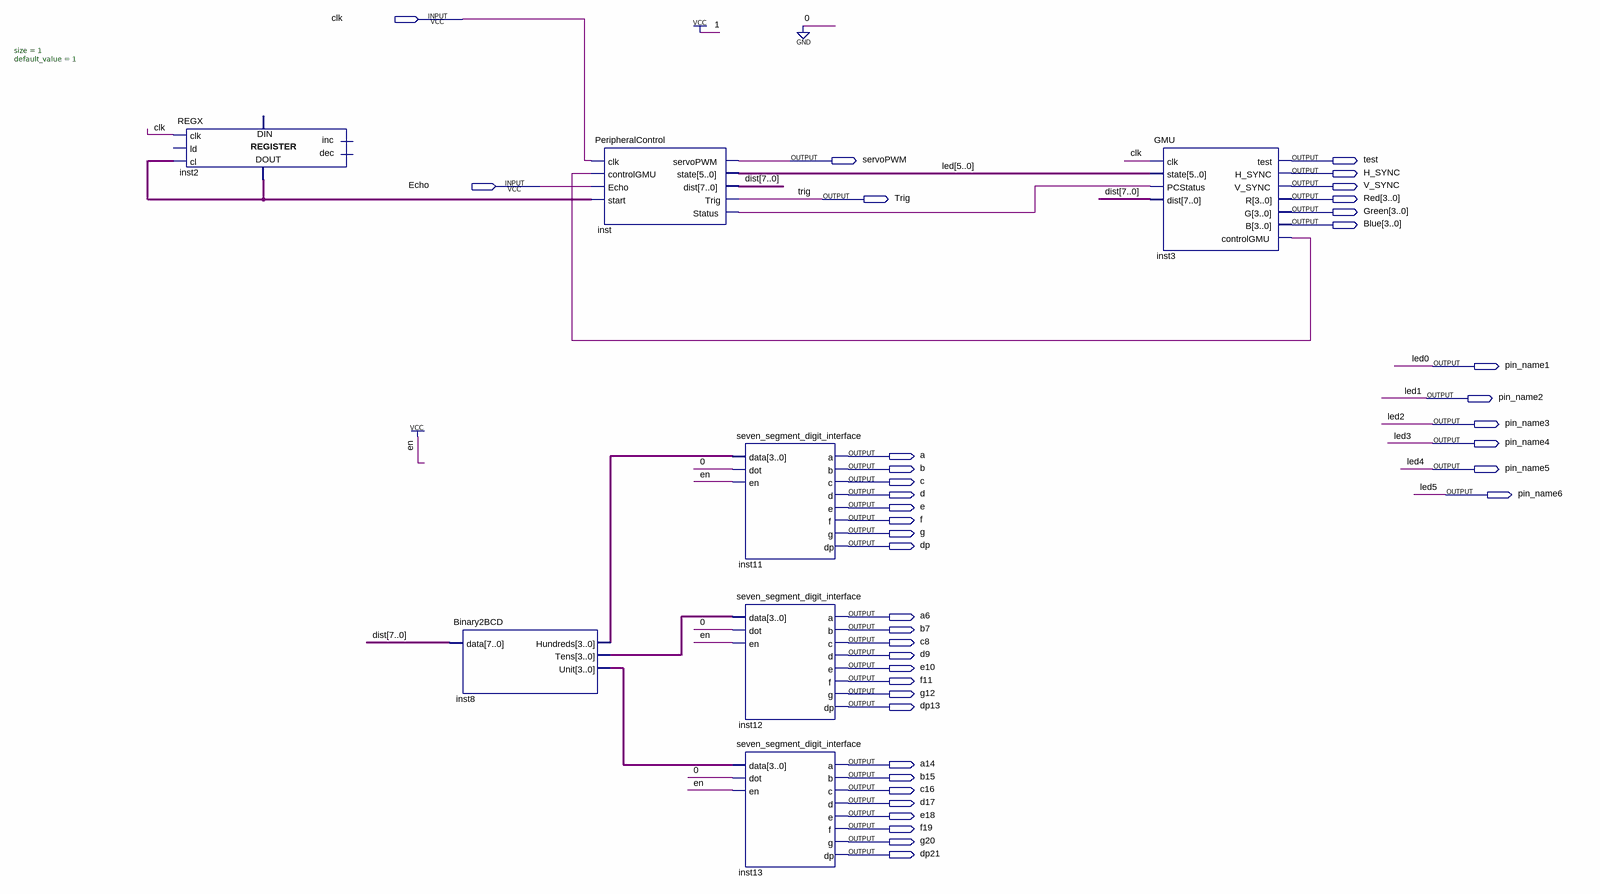
[diagram p0: schematic sheet]
// Quartus schematic Main.bdf as structural Verilog: 7 symbols, 40 pins
module Main (
  input  clk,
  input  Echo,
  output servoPWM,
  output test,
  output H_SYNC,
  output V_SYNC,
  output Trig,
  output [3:0] Red,
  output [3:0] Green,
  output [3:0] Blue,
  output pin_name1,
  output pin_name2,
  output pin_name3,
  output pin_name4,
  output a,
  output b,
  output pin_name5,
  output c,
  output d,
  output pin_name6,
  output e,
  output f,
  output g,
  output dp,
  output a6,
  output b7,
  output c8,
  output d9,
  output e10,
  output f11,
  output g12,
  output dp13,
  output a14,
  output b15,
  output c16,
  output d17,
  output e18,
  output f19,
  output g20,
  output dp21
);

  wire inst2_data_out, inst3_controlgmu, inst_status;
  wire [3:0] inst8_hundreds, inst8_tens, inst8_unit;
  wire [7:0] \dist ;

  REGX #(.size(1), .default_value(1)) inst2 (
    .clk(clk), .cl(inst2_data_out), .data_out(inst2_data_out));  // open: ld, inc, dec, data_in
  Binary2BCD inst8 (.data(\dist ), .Hundreds(inst8_hundreds), .Tens(inst8_tens), .Unit(inst8_unit));
  PeripheralControl inst (
    .clk(clk), .controlGMU(inst3_controlgmu), .Echo(Echo), .start(inst2_data_out), .servoPWM(servoPWM),
    .state({pin_name6, pin_name5, pin_name4, pin_name3, pin_name2, pin_name1}), .\dist (\dist ), .Trig(Trig),
    .Status(inst_status));
  seven_segment_digit_interface inst11 (
    .data(inst8_hundreds), .dot(1'b0), .en(1'b1), .a(a), .b(b), .c(c), .d(d), .e(e), .f(f), .g(g), .dp(dp));
  seven_segment_digit_interface inst12 (
    .data(inst8_tens), .dot(1'b0), .en(1'b1), .a(a6), .b(b7), .c(c8), .d(d9), .e(e10), .f(f11), .g(g12),
    .dp(dp13));
  seven_segment_digit_interface inst13 (
    .data(inst8_unit), .dot(1'b0), .en(1'b1), .a(a14), .b(b15), .c(c16), .d(d17), .e(e18), .f(f19), .g(g20),
    .dp(dp21));
  GMU inst3 (
    .clk(clk), .state({pin_name6, pin_name5, pin_name4, pin_name3, pin_name2, pin_name1}),
    .PCStatus(inst_status), .\dist (\dist ), .test(test), .H_SYNC(H_SYNC), .V_SYNC(V_SYNC), .R(Red),
    .G(Green), .B(Blue), .controlGMU(inst3_controlgmu));

  // Other names for the same wires on the sheet: led[5:0] = {pin_name6, pin_name5, pin_name4, pin_name3, pin_name2, pin_name1};
  //   led0 = pin_name1; led1 = pin_name2; led2 = pin_name3; led3 = pin_name4; led4 = pin_name5; led5 = pin_name6
endmodule
